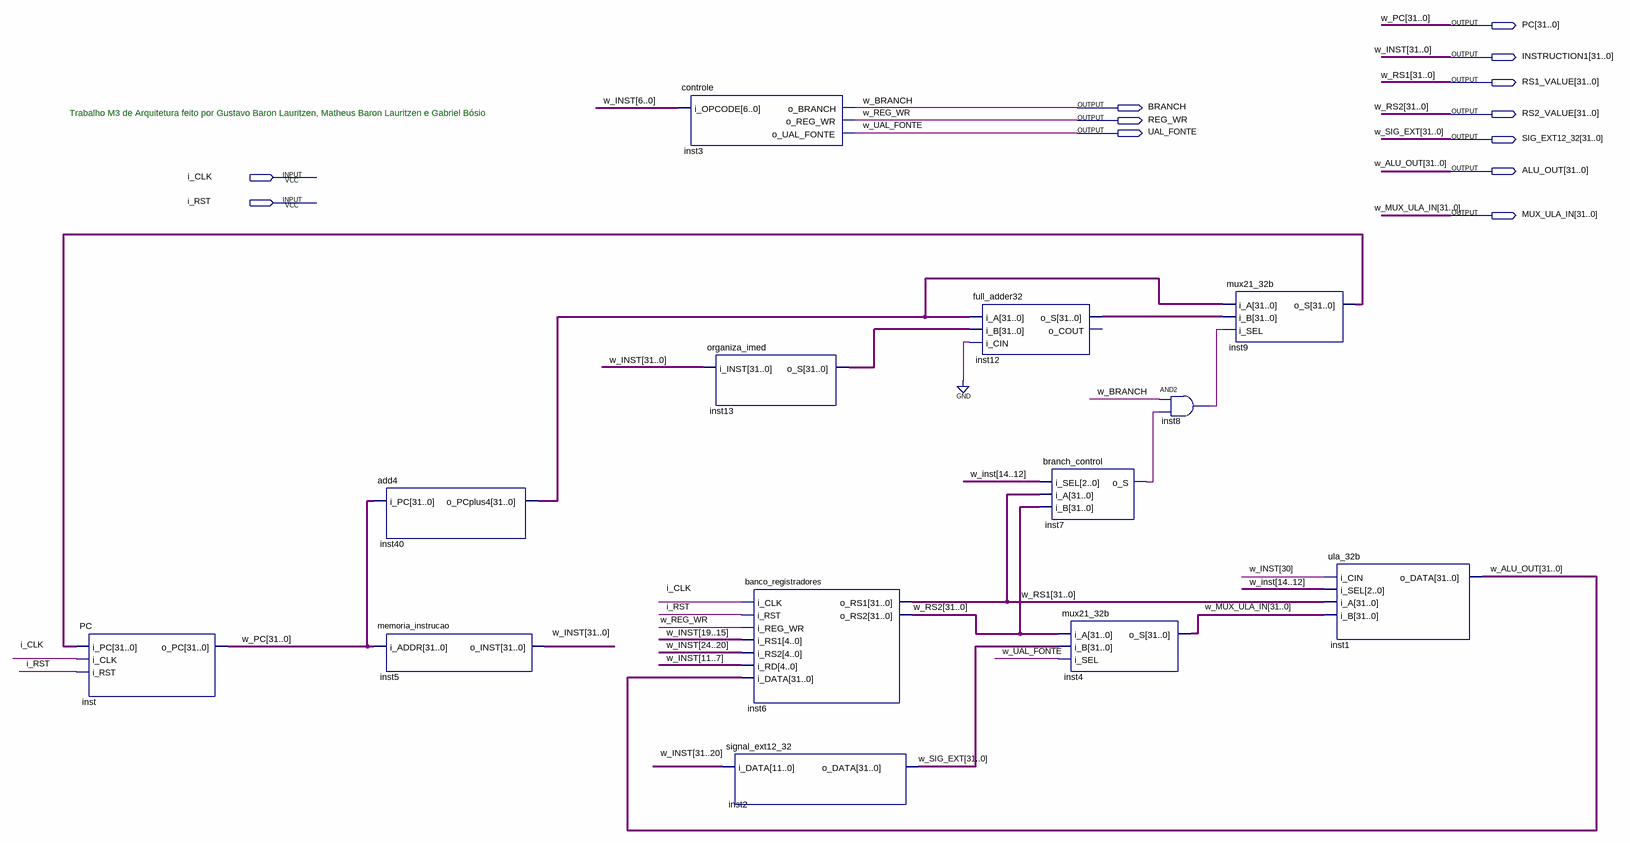
[diagram p0: schematic sheet]
// Quartus schematic risc_v32i.bdf as structural Verilog: 13 symbols, 12 pins
module risc_v32i (
  input  i_CLK,
  input  i_RST,
  output [31:0] PC,
  output [31:0] INSTRUCTION1,
  output [31:0] RS1_VALUE,
  output BRANCH,
  output [31:0] RS2_VALUE,
  output REG_WR,
  output UAL_FONTE,
  output [31:0] SIG_EXT12_32,
  output [31:0] ALU_OUT,
  output [31:0] MUX_ULA_IN
);

  wire inst7_o_s, inst8_out;
  wire [31:0] inst9_o_s, inst12_o_s, inst13_o_s, inst40_o_pcplus4;

  PC inst (.i_PC(inst9_o_s), .i_CLK(i_CLK), .i_RST(i_RST), .o_PC(PC));
  add4 inst40 (.i_PC(PC), .o_PCplus4(inst40_o_pcplus4));
  memoria_instrucao inst5 (.i_ADDR(PC), .o_INST(INSTRUCTION1));
  controle inst3 (.i_OPCODE(INSTRUCTION1[6:0]), .o_BRANCH(BRANCH), .o_REG_WR(REG_WR), .o_UAL_FONTE(UAL_FONTE));
  organiza_imed inst13 (.i_INST(INSTRUCTION1), .o_S(inst13_o_s));
  banco_registradores inst6 (
    .i_CLK(i_CLK), .i_RST(i_RST), .i_REG_WR(REG_WR), .i_RS1(INSTRUCTION1[19:15]),
    .i_RS2(INSTRUCTION1[24:20]), .i_RD(INSTRUCTION1[11:7]), .i_DATA(ALU_OUT), .o_RS1(RS1_VALUE),
    .o_RS2(RS2_VALUE));
  signal_ext12_32 inst2 (.i_DATA(INSTRUCTION1[31:20]), .o_DATA(SIG_EXT12_32));
  full_adder32 inst12 (.i_A(inst40_o_pcplus4), .i_B(inst13_o_s), .i_CIN(1'b0), .o_S(inst12_o_s));  // open: o_COUT
  branch_control inst7 (.i_SEL(INSTRUCTION1[14:12]), .i_A(RS1_VALUE), .i_B(RS2_VALUE), .o_S(inst7_o_s));
  mux21_32b inst4 (.i_A(RS2_VALUE), .i_B(SIG_EXT12_32), .i_SEL(UAL_FONTE), .o_S(MUX_ULA_IN));
  and inst8 (inst8_out, BRANCH, inst7_o_s);
  mux21_32b inst9 (.i_A(inst40_o_pcplus4), .i_B(inst12_o_s), .i_SEL(inst8_out), .o_S(inst9_o_s));
  ula_32b inst1 (
    .i_CIN(INSTRUCTION1[30]), .i_SEL(INSTRUCTION1[14:12]), .i_A(RS1_VALUE), .i_B(MUX_ULA_IN), .o_DATA(ALU_OUT));

  // Other names for the same wires on the sheet: w_ALU_OUT[31:0] = ALU_OUT; w_BRANCH = BRANCH;
  //   w_INST[31:0] = INSTRUCTION1; w_MUX_ULA_IN[31:0] = MUX_ULA_IN; w_PC[31:0] = PC; w_REG_WR = REG_WR;
  //   w_RS1[31:0] = RS1_VALUE; w_RS2[31:0] = RS2_VALUE; w_SIG_EXT[31:0] = SIG_EXT12_32; w_UAL_FONTE = UAL_FONTE

  // Notes on the sheet:
  //   Trabalho M3 de Arquitetura feito por Gustavo Baron Lauritzen, Matheus Baron Lauritzen e Gabriel Bósio
endmodule
